# EAGLE schematic untitled (EAGLE 7.2.0)
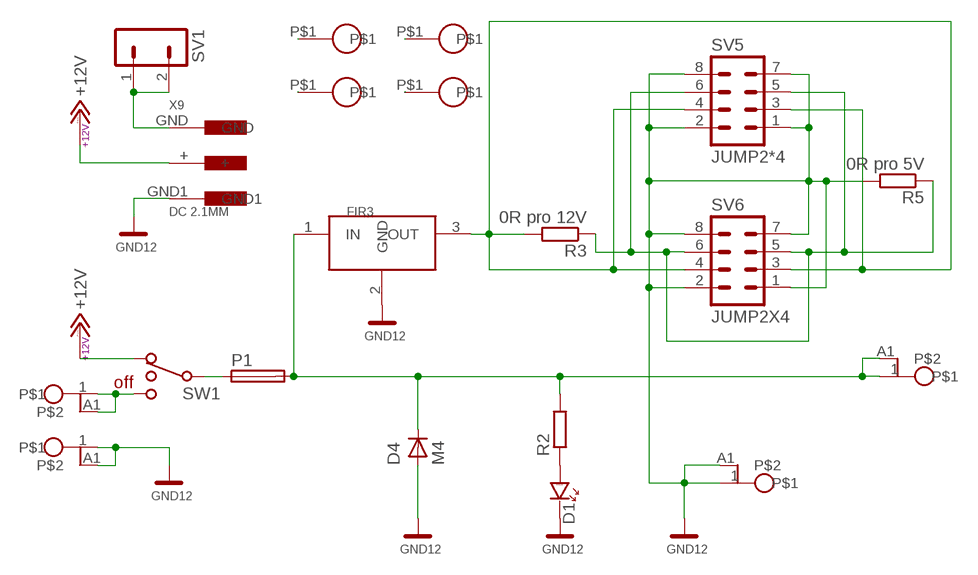
[diagram p0: schematic, sheet 1]

## Parts
D1  D_LED_3MM  [D_LED_3]
D4  M4  D-OB.SMA  [SMA]
FIR3  FILTR0805  [F0805]
P1  POJISTKA_1812  [1812]
R2  R-EU_R0805  [R0805]
R3  0R pro 12V  R-EU_R0805  [R0805]
R5  0R pro 5V  R-EU_R0805  [R0805]
SV1  MA02-1  [MA02-1]
SV5  JUMP2*4  MA04-2  [MA04-2]
SV6  JUMP2X4  MA04-2  [MA04-2]
SW1  PREPINAC_POSUVNY_SL19-121  [PREPINAC-POSUVNÝ]
X1  WAGO256  [WAGO256]
X2  WAGO256  [WAGO256]
X3  WAGO256  [WAGO256]
X4  M3  SROUB3M  [SROUB3M]
X5  M3  SROUB3M  [SROUB3M]
X6  M3  SROUB3M  [SROUB3M]
X7  M3  SROUB3M  [SROUB3M]
X8  WAGO256  [WAGO256]
X9  DC 2.1MM  KONEKTOR_DC_2.1MM  [KONEKTOR_DC_2.1MM]

## Nets
+12V: SW1.1 X9.+
GND12: D1.K D4.A FIR3.2(GND) R5.2 SV5.1 SV5.2 SV5.7 SV5.8 SV6.1 SV6.2 SV6.7 SV6.8 X2.1 X2.A1 X3.1 X3.A1 X9.GND1
N$1: SW1.3 X1.1 X1.A1
N$2: D1.A R2.1
N$4: R3.1 R5.1 SV5.5 SV5.6 SV6.5 SV6.6
N$5: SV1.1 SV1.2 X9.GND
N$6: FIR3.3(OUT) R3.2 SV5.3 SV5.4 SV6.3 SV6.4
N$7: P1.1 SW1.2
N$9: D4.K(C) FIR3.1(IN) P1.2 R2.2 X8.1 X8.A1
N$13: X6.P$1
N$14: X4.P$1
N$15: X7.P$1
N$16: X5.P$1

## Library data of the parts
D1 = moje:D_LED_3MM: LED dioda 3mm
D4 = moje:D-OB.SMA: SMA
FIR3 = moje:FILTR0805
P1 = moje:POJISTKA_1812: Pojistka s pouzdrem 1812
R2 R3 R5 = rcl:R-EU_: RESISTOR, European symbol
SV1 = moje_hrebinky:MA02-1
SV5 SV6 = con-lstb:MA04-2: PIN HEADER; OC_FARNELL: unknown; OC_NEWARK: unknown
SW1 = moje:PREPINAC_POSUVNY_SL19-121
X1-X3 X8 = PaJa_22:WAGO256: Konektor WAGO - RM 5,08mm - s packou
X4-X7 = moje:SROUB3M
X9 = moje:KONEKTOR_DC_2.1MM: KONEKTOR DC 2.1MM